# Altium schematic sheet 3 - Position2Go_RF_Section.SchDoc
size A3; Release: RC00; PageSetup: Record=PageOptions|CenterHorizontal=True|CenterVertical=True|PrintScale=1.01|XCorrection=1.00|YCorrection=1.00|PrintKind=0|BorderSize=5000000|LeftOffset=0|BottomOffset=0|Orientation=2|PaperLength=1000|PaperWidth=1000|Scale=100|PaperSource=7|PrintQuality=-4|MediaType=1|DitherType=10|PaperKind=A3|PrintScaleMode=1; Doc_ConfidentialStatus: <Doc_ConfidentialStatus>; Doc_Preliminary: <Doc_Preliminary>
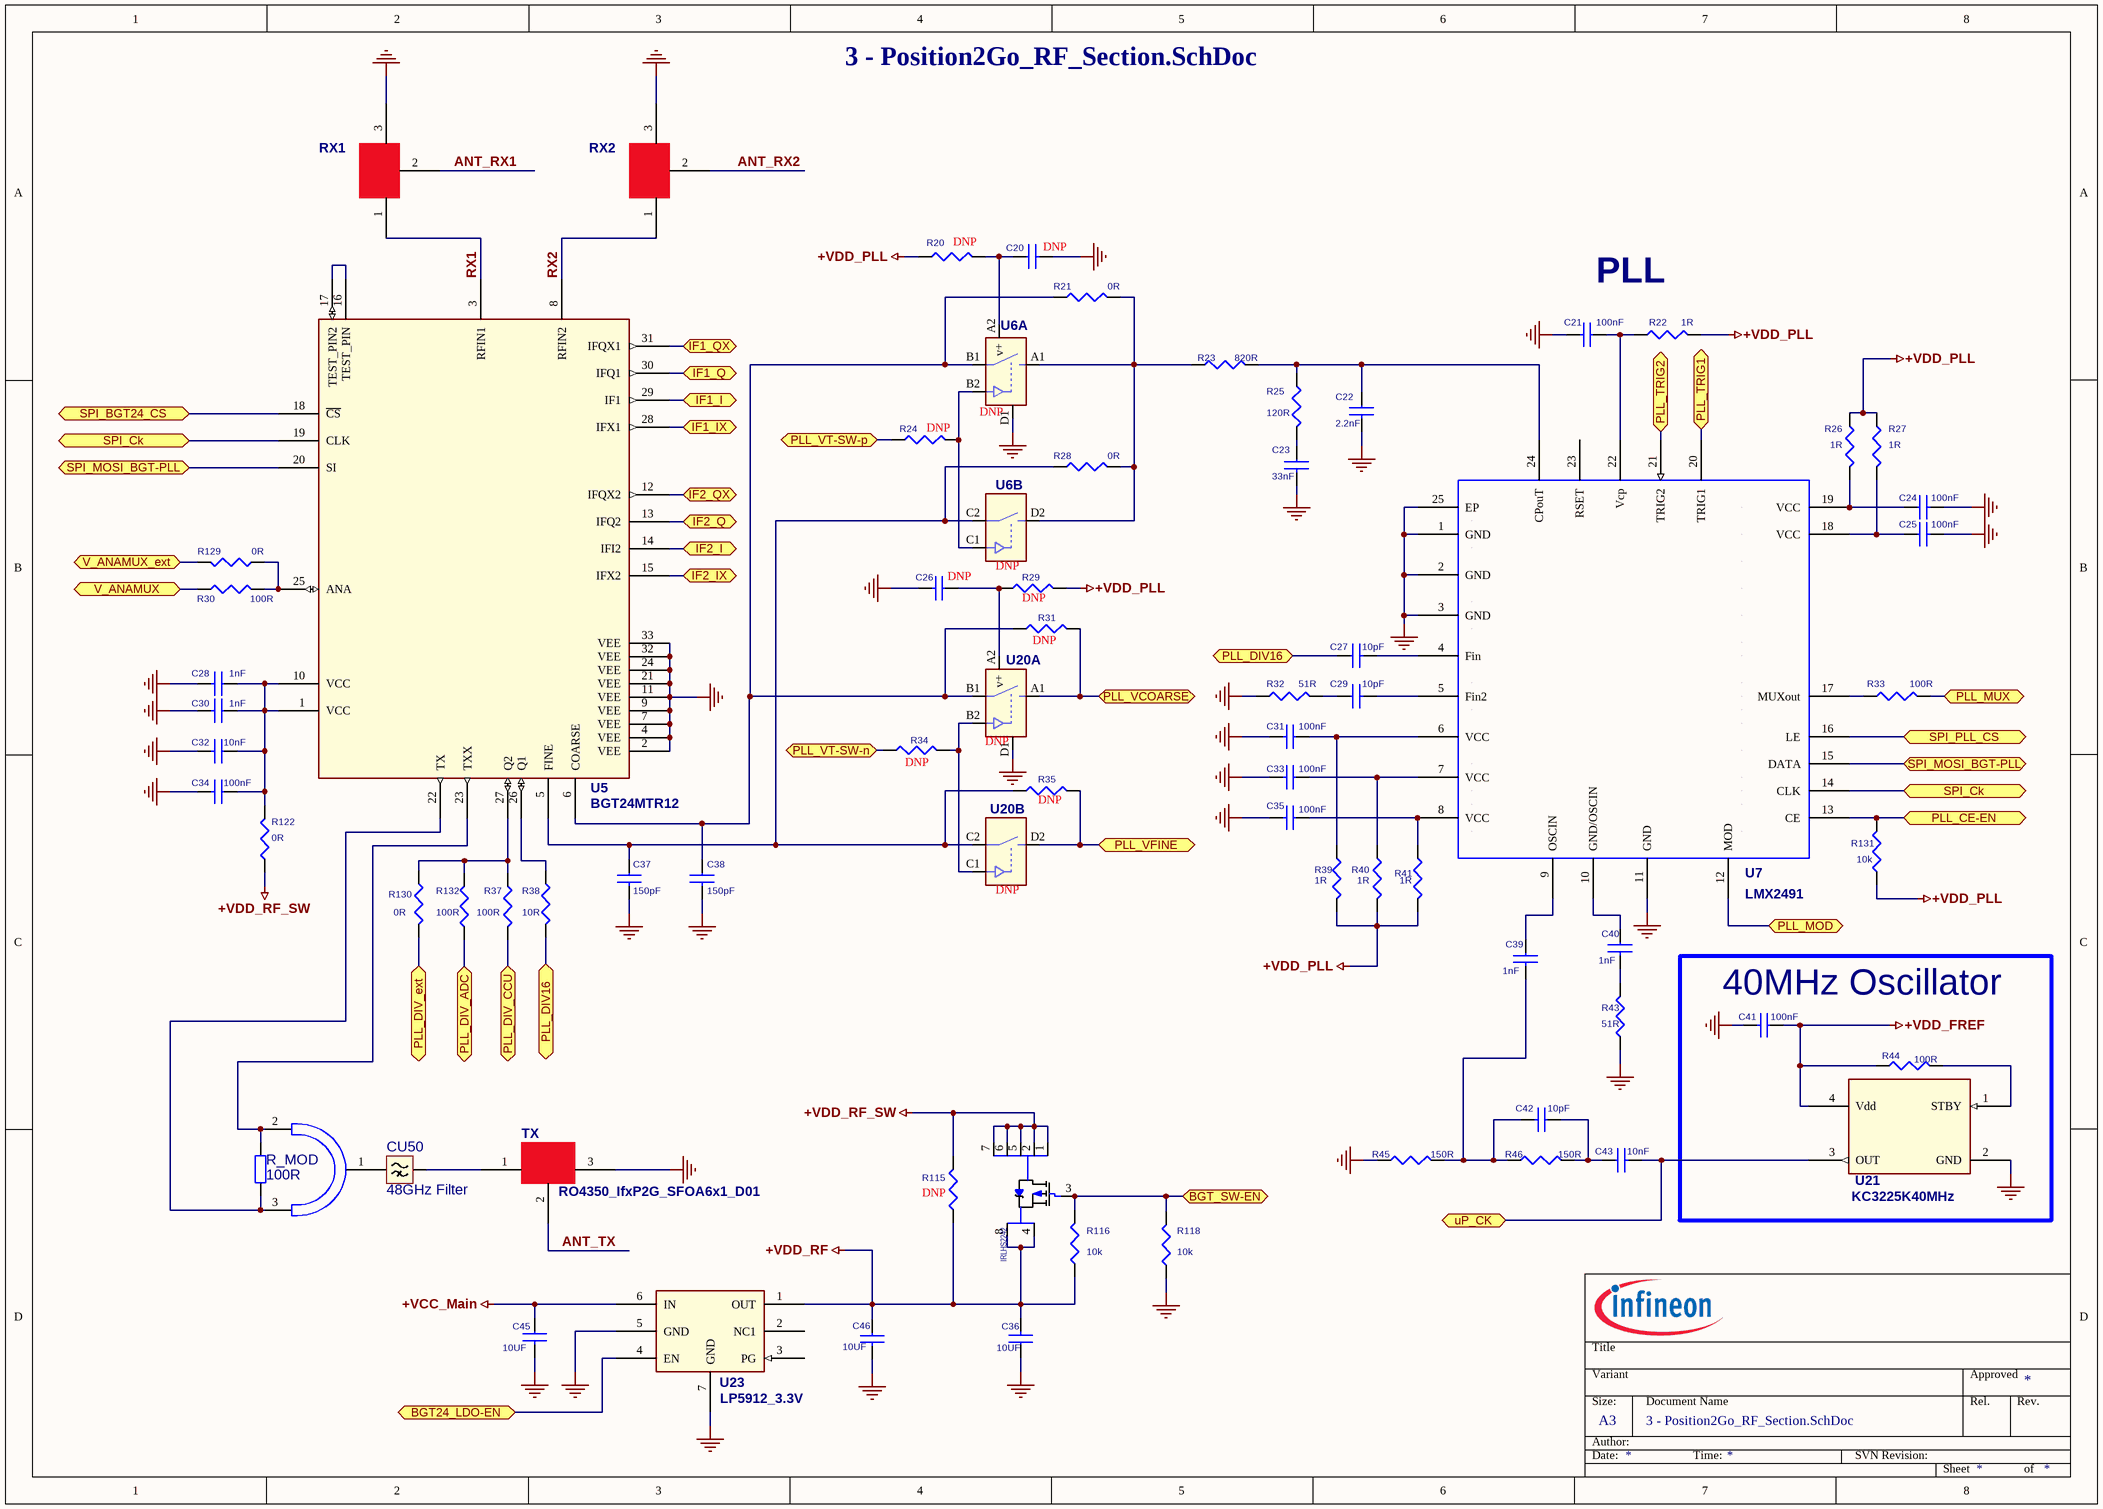
[diagram p0: 3 - Position2Go_RF_Section.SchDoc]

## Parts
C20  DNP  [C_0201]  (value not drawn)
C21  100nF  [C_0201]
C22  2.2nF  [0402_durac]
C23  33nF  [0402_durac]
C24  100nF  [C_0201]
C25  100nF  [C_0201]
C26  DNP  [C_0201]  (value not drawn)
C27  10pF  [C_0201]
C28  1nF  [C_0201]
C29  10pF  [C_0201]
C30  1nF  [C_0201]
C31  100nF  [C_0201]
C32  10nF  [C_0201]
C33  100nF  [C_0201]
C34  100nF  [C_0201]
C35  100nF  [C_0201]
C36  10UF  [0402_durac]
C37  150pF  [C_0201]
C38  150pF  [C_0201]
C39  1nF  [C_0201]
C40  1nF  [C_0201]
C41  100nF  [C_0201]
C42  10pF  [C_0201]
C43  10nF  [C_0201]
C45  10UF  [0402_durac]
C46  10UF  [0402_durac]
CU1  Divider  [WILKSON]  (value not drawn)  (net tie, no BOM)
CU50  48GHz Filter  [48GHz_Filter]  (net tie, no BOM)
Q1  IRLHS2242  [IRLSH2242]  (value not drawn)
R20  DNP  [R_0201]  (value not drawn)
R21  0R  [R_0201]
R22  1R  [R_0201]
R23  820R  [0402_durac]
R24  DNP  [R_0201]  (value not drawn)
R25  120R  [0402-A]
R26  1R  [R_0201]
R27  1R  [R_0201]
R28  0R  [R_0201]
R29  DNP  [R_0201]  (value not drawn)
R30  100R  [R_0201]
R31  DNP  [R_0201]  (value not drawn)
R32  51R  [R_0201]
R33  100R  [R_0201]
R34  DNP  [R_0201]  (value not drawn)
R35  DNP  [R_0201]  (value not drawn)
R37  100R  [R_0201]
R38  10R  [R_0201]
R39  1R  [R_0201]
R40  1R  [R_0201]
R41  1R  [R_0201]
R43  51R  [R_0201]
R44  100R  [R_0201]
R45  150R  [R_0201]
R46  150R  [R_0201]
R115  DNP  [R_0201]  (value not drawn)
R116  10k  [R_0201]
R118  10k  [R_0201]
R122  0R  [0603]
R129  0R  [R_0201]
R130  0R  [R_0201]
R131  10k  [R_0201]
R132  100R  [R_0201]
R_MOD  value 100R  [24GHZ_Wilkinson_R]  (hidden comment: RES-100R-50V-1%-0603)
RX1  RO4350_IfxP2G_SFOA6x1_D01  [RO4350_IfxP2G_SFPA6x1_D01_RX1_L]  (value not drawn)  (net tie, no BOM)
RX2  RO4350_IfxP2G_SFOA6x1_D01  [RO4350_IfxP2G_SFPA6x1_D01_RX1]  (value not drawn)  (net tie, no BOM)
TX  RO4350_IfxP2G_SFOA6x1_D01  [RO4350_IfxP2G_SFPA6x1_D01_Tx]  (net tie, no BOM)
U5  BGT24MTR12  [VQFN32-9]
U6  DNP  [OPA2376_DSBGA]  (value not drawn)  (parts A,B of 2)
U7  LMX2491  [VFQN_24]
U20  DNP  [OPA2376_DSBGA]  (value not drawn)  (parts A,B of 2)
U21  KC3225K40MHz  [3525_40MHz]
U23  LP5912_3.3V  [DRV6_1P6X1]

## Blocks framed on the sheet
40MHz Oscillator: C41 R44 U21

## Ports
BGT24_LDO-EN (bidir), BGT_SW-EN (bidir), IF1_I (bidir), IF1_IX (bidir), IF1_Q (bidir), IF1_QX (bidir), IF2_I (bidir), IF2_IX (bidir), IF2_Q (bidir), IF2_QX (bidir), PLL_CE-EN (bidir), PLL_DIV16 (bidir), PLL_DIV_ADC (bidir), PLL_DIV_CCU (bidir), PLL_DIV_ext (bidir), PLL_MOD (bidir), PLL_MUX (bidir), PLL_TRIG1 (bidir), PLL_TRIG2 (bidir), PLL_VCOARSE (bidir), PLL_VFINE (bidir), PLL_VT-SW-n (bidir), PLL_VT-SW-p (bidir), SPI_BGT24_CS (bidir), SPI_Ck (bidir), SPI_MOSI_BGT-PLL (bidir), SPI_PLL_CS (bidir), uP_CK (bidir), V_ANAMUX (bidir), V_ANAMUX_ext (bidir)

## Nets
+VCC_Main: C45.1 U23.6(IN)
+VDD_FREF: C41.1 R44.2 U21.4(Vdd)
+VDD_PLL: R20.2 R22.2 R26.1 R27.1 R29.2 R39.2 R40.2 R41.2 R131.1
+VDD_RF: C36.2 C46.1 Q1.4(source) Q1.8(source) R115.1 R116.1 U23.1(OUT)
+VDD_RF_SW: Q1.1(DRAIN) Q1.2(DRAIN) Q1.5(DRAIN) Q1.6(DRAIN) Q1.7(DRAIN) R115.2 R122.1
GND_POWER: C20.2 C21.2 C22.2 C23.2 C24.2 C25.2 C26.2 C28.2 C30.2 C31.2 C32.2 C33.2 C34.2 C35.2 C36.1 C37.2 C38.2 C41.2 C45.2 C46.2 R32.1 R43.1 R45.2 R118.1 RX1.3 RX2.3 TX.3 U5.2(VEE) U5.4(VEE) U5.7(VEE) U5.9(VEE) U5.11(VEE) U5.21(VEE) U5.24(VEE) U5.32(VEE) U5.33(VEE) U6.D1(GND) U7.1(GND) U7.2(GND) U7.3(GND) U7.11(GND) U7.25(EP) U20.D1(GND) U21.2(GND) U23.5(GND) U23.7(GND)
ANT_RX1: RX1.2
ANT_RX2: RX2.2
ANT_TX: TX.2
BGT24_LDO-EN: U23.4(EN) ; port BGT24_LDO-EN
BGT_SW-EN: Q1.3(GATE) R116.2 R118.2 ; port BGT_SW-EN
IF1_I: U5.29(IF1) ; port IF1_I
IF1_IX: U5.28(IFX1) ; port IF1_IX
IF1_Q: U5.30(IFQ1) ; port IF1_Q
IF1_QX: U5.31(IFQX1) ; port IF1_QX
IF2_I: U5.14(IFI2) ; port IF2_I
IF2_IX: U5.15(IFX2) ; port IF2_IX
IF2_Q: U5.13(IFQ2) ; port IF2_Q
IF2_QX: U5.12(IFQX2) ; port IF2_QX
PLL_CE-EN: R131.2 U7.13(CE) ; port PLL_CE-EN
PLL_DIV16: C27.1 R38.2 ; port PLL_DIV16
PLL_DIV_ADC: R132.1 ; port PLL_DIV_ADC
PLL_DIV_CCU: R37.1 ; port PLL_DIV_CCU
PLL_DIV_ext: R130.2 ; port PLL_DIV_ext
PLL_MOD: U7.12(MOD) ; port PLL_MOD
PLL_MUX: R33.2 ; port PLL_MUX
PLL_TRIG1: U7.20(TRIG1) ; port PLL_TRIG1
PLL_TRIG2: U7.21(TRIG2) ; port PLL_TRIG2
PLL_VCOARSE: R31.2 U20.A1(NO1) ; port PLL_VCOARSE
PLL_VFINE: R35.2 U20.D2(NO2) ; port PLL_VFINE
PLL_VT-SW-n: R34.1 ; port PLL_VT-SW-n
PLL_VT-SW-p: R24.1 ; port PLL_VT-SW-p
RX1: RX1.1 U5.3(RFIN1)
RX2: RX2.1 U5.8(RFIN2)
SPI_BGT24_CS: U5.18(~{CS}) ; port SPI_BGT24_CS
SPI_Ck: U5.19(CLK) U7.14(CLK) ; port SPI_Ck
SPI_MOSI_BGT-PLL: U5.20(SI) U7.15(DATA) ; port SPI_MOSI_BGT-PLL
SPI_PLL_CS: U7.16(LE) ; port SPI_PLL_CS
uP_CK: C43.2 U21.3(OUT) ; port uP_CK
V_ANAMUX: R30.1 ; port V_ANAMUX
V_ANAMUX_ext: R129.2 ; port V_ANAMUX_ext
NetC20_1: C20.1 R20.1 U6.A2(v+)
NetC21_1: C21.1 R22.1 U7.22(Vcp)
NetC22_1: C22.1 R23.2 R25.1 U7.24(CPouT)
NetC23_1: C23.1 R25.2
NetC24_1: C24.1 R26.2 U7.19(VCC)
NetC25_1: C25.1 R27.2 U7.18(VCC)
NetC26_1: C26.1 R29.1 U20.A2(v+)
NetC27_2: C27.2 U7.4(Fin)
NetC28_1: C28.1 C30.1 C32.1 C34.1 R122.2 U5.1(VCC) U5.10(VCC)
NetC29_1: C29.1 R32.2
NetC29_2: C29.2 U7.5(Fin2)
NetC31_1: C31.1 R39.1 U7.6(VCC)
NetC33_1: C33.1 R40.1 U7.7(VCC)
NetC35_1: C35.1 R41.1 U7.8(VCC)
NetC37_1: C37.1 R28.1 R35.1 U5.5(FINE) U6.C2(COM2) U20.C2(COM2)
NetC38_1: C38.1 R21.1 R31.1 U5.6(COARSE) U6.B1(COM1) U20.B1(COM1)
NetC39_1: C39.1 U7.9(OSCIN)
NetC39_2: C39.2 C42.2 R45.1 R46.2
NetC40_1: C40.1 U7.10(GND/OSCIN)
NetC40_2: C40.2 R43.2
NetC42_1: C42.1 C43.1 R46.1
NetCU1_1: CU1.1(P1) CU50.2
NetCU1_2: CU1.2(P2) R_MOD.1(P1) U5.23(TXX)
NetCU1_3: CU1.3(P3) R_MOD.2(P2) U5.22(TX)
NetCU50_1: CU50.1 TX.1
NetR21_2: R21.2 R23.1 R28.2 U6.A1(NO1) U6.D2(NO2)
NetR24_2: R24.2 U6.B2(IN1) U6.C1(IN2)
NetR30_2: R30.2 R129.1 U5.25(ANA)
NetR33_1: R33.1 U7.17(MUXout)
NetR34_2: R34.2 U20.B2(IN1) U20.C1(IN2)
NetR37_2: R37.2 R130.1 R132.2 U5.27(Q2)
NetR38_1: R38.1 U5.26(Q1)
NetR44_1: R44.1 U21.1(STBY)
NetU5_16: U5.16(TEST_PIN) U5.17(TEST_PIN2)

Not connected (* = marked no-connect by the designer): U7 23(RSET); U23 2(NC1) 3(PG)

## Notes on the sheet
- (near R20) DNP
- (near C20) DNP
- PLL
- (near R24) DNP
- (near U6) DNP
- (near C26) DNP
- DNP
- (near R29) DNP
- (near R31) DNP
- (near R34) DNP
- (near U20) DNP
- (near R35) DNP
- (near R115) DNP
- Title
- Variant
- Approved
- Date:
- Author:
- Size:
- A3
- Document Name
- Time:
- SVN Revision:
- Rel.
- Rev.
- Sheet
- of

## Library data of the parts
C20 C26 = 100nF_Dup1: NB Not Fitted; code_DK: 490-10430-1-ND; Voltage: 50V; Tolerance: 5%; Part Type: capacitor\ceramic
C21 C24 C25 C31 C33-C35 C41 = 100nF_Dup1: code_DK: 490-10430-1-ND; Voltage: 50V; Tolerance: 5%; Part Type: capacitor\ceramic
C22 = 3.9nF: Voltage: 50V; Tolerance: 5%; Temperature coefficient: COG/NPO; Part Type: capacitor\ceramic
C23 = 68nF: Temperature coefficient: X7R; Tolerance: 10%; Voltage: 50V; Part Type: capacitor\ceramic
C27 C29 C42 = 10pF: 10pF  ±1%  50V  NPO; code_DK: 490-7750-1-ND; Voltage: 50V; Part Type: capacitor\ceramic; Tolerance: 1%
C28 C30 C39 C40 = 1nF: Tolerance: 10%; Voltage: 25V; code_DK: 445-4695-1-ND; Part Type: capacitor\ceramic
C32 C43 = 10nF: Tolerance: 10%; Voltage: 10V; code_DK: 490-7223-1-ND; Part Type: capacitor\ceramic
C36 C45 C46 = 10UF: Temperature coefficient: X5R; Tolerance: 20%; Voltage: 10V; code_DK: 1276-1450-1-ND; Part Type: capacitor\ceramic
C37 C38 = 100pF: 150pF  ±5%  25V  NPO; code_DK: 587-3799-1-ND; Tolerance: 5%; Part Type: capacitor\ceramic; Voltage: 25V
CU1 = WILKINSON: Preis: 0.0; FootprintBOM: -
CU50 = 48GHz_Filter: Preis: 0.0; FootprintBOM: -
Q1 = IRLHS2242: code_DK: IRLHS2242TRPBFCT-ND
R20 R29 R31 R35 R115 = 0_Dup2: NB Not Fitted; code_DK: 311-0.0NCT-ND; tolerance: 1%; Power: 0.063W; size: 0201
R21 R28 R129 R130 = 0_Dup2: code_DK: 311-0.0NCT-ND; tolerance: 1%; Power: 0.063W; size: 0201
R22 R26 R27 R39-R41 = 1: Power: 0.063W; tolerance: 1%; code_DK: YAG3368CT-ND; size: 0201
R23 = 0_Dup1: Power: 0.063W; tolerance: 5%; size: 0402
R24 R34 = 100: NB Not Fitted; code_DK: 311-100MCT-ND; tolerance: 1%; Power: 0.063W; size: 0201
R25 = 20: Power: 0.063W; tolerance: 1%; size: 0402
R30 R33 R37 R44 R132 = 100: code_DK: 311-100MCT-ND; tolerance: 1%; Power: 0.063W; size: 0201
R32 R43 = 51: code_DK: YAG2288CT-ND; tolerance: 1%; Power: 0.063W; size: 0201
R38 = 10: code_DK: 541-10.0ABCT-ND; tolerance: 1%; Power: 0.063W; size: 0201
R45 R46 = 150: tolerance: 1%; Power: 0.063W; size: 0201
R116 R118 R131 = 10K_Dup1: code_DK_reel: 311-1KMDKR-ND; code_DK: 311-10.0KMCT-ND; tolerance: 1%; Power: 0.063W; size: 0201
R122 = 0: 0R 0603; code_DK: MCT0603-0.0-ZZDKR-ND; tolerance: 1%; Power: 0.125W; size: 0603
R_MOD = WILKINSON_0402: Resistor; Manufacturer: Multicomp; Bestellnummer: 9330364; Preis: 0.007; FootprintBOM: 0402; Link: http://de.farnell.com/multicomp/mc0063w06031100r/widerstand-100r-0-063w-1-0603/dp/9330364
U5 = BGT24ATR12: code_DK: BGT24MTR12E6327XUMA1CT-ND
U6 U20 = TS5A23166_DSBGA: NB Not Fitted; code_DK: 296-21183-1-ND
U7 = LMX2491: IsHeterogeneous: False; DevicesInView: 1; DeviceDesignator: A; DeviceNumbering: Alpha; OriginalSymbolOrigin: (30000,20000); code_DK: 296-45092-1-ND; DevicesInPackage: 1
U21 = K3525_40MHz: code_DK: 1253-1412-1-ND
U23 = LP5912_3_3V: code_DK: 296-44153-1-ND